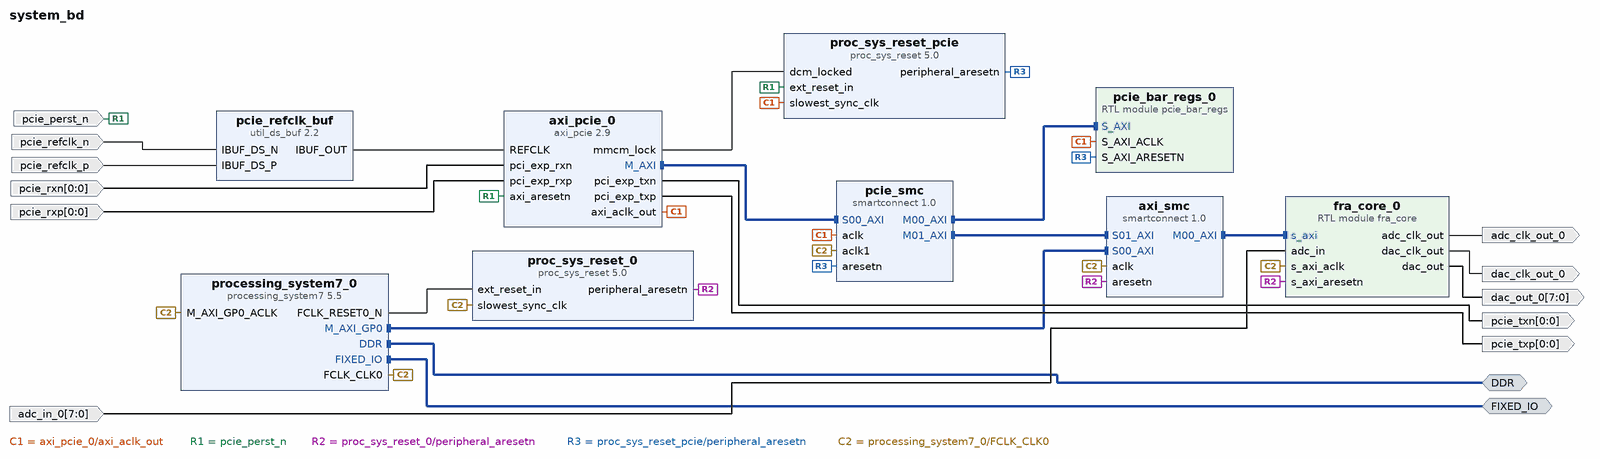
[diagram p0: block diagram of the top level]
# Vivado block design system_bd, xc7z015clg485-2, Vivado 2026.1
create_bd_design system_bd

create_bd_intf_port -mode Master -vlnv xilinx.com:interface:ddrx_rtl:1.0 DDR
create_bd_intf_port -mode Master -vlnv xilinx.com:display_processing_system7:fixedio_rtl:1.0 FIXED_IO
create_bd_port -dir O dac_clk_out_0
create_bd_port -dir O adc_clk_out_0
create_bd_port -dir O -from 7 -to 0 dac_out_0
create_bd_port -dir I -from 7 -to 0 adc_in_0
create_bd_port -dir O -from 0 -to 0 pcie_txp
create_bd_port -dir O -from 0 -to 0 pcie_txn
create_bd_port -dir I -from 0 -to 0 pcie_rxp
create_bd_port -dir I -from 0 -to 0 pcie_rxn
create_bd_port -dir I pcie_perst_n
create_bd_port -dir I pcie_refclk_p
create_bd_port -dir I pcie_refclk_n

create_bd_cell -type ip -vlnv xilinx.com:ip:processing_system7:5.5 processing_system7_0
set_property -dict [list \
  CONFIG.PCW_QSPI_GRP_SINGLE_SS_ENABLE 1 \
  CONFIG.PCW_QSPI_GRP_SINGLE_SS_IO {MIO 1 .. 6} \
  CONFIG.PCW_QSPI_PERIPHERAL_ENABLE 1 \
  CONFIG.PCW_QSPI_QSPI_IO {MIO 1 .. 6} \
  CONFIG.PCW_SINGLE_QSPI_DATA_MODE x4 \
  CONFIG.PCW_UART0_PERIPHERAL_ENABLE 1 \
  CONFIG.PCW_UART0_UART0_IO {MIO 14 .. 15} \
  CONFIG.PCW_UART1_PERIPHERAL_ENABLE 1 \
  CONFIG.PCW_UART1_UART1_IO {MIO 12 .. 13} \
  CONFIG.PCW_UART_PERIPHERAL_FREQMHZ 100 \
  CONFIG.PCW_UIPARAM_DDR_PARTNO {MT41J256M16 RE-125} \
] [get_bd_cells processing_system7_0]
# 68 more settings of processing_system7_0 are not shown: defaults, MIO pin electricals, DDR timing, and values the tool derives
create_bd_cell -type ip -vlnv xilinx.com:ip:proc_sys_reset:5.0 proc_sys_reset_0
create_bd_cell -type module -reference fra_core fra_core_0
create_bd_cell -type ip -vlnv xilinx.com:ip:smartconnect:1.0 axi_smc
set_property -dict {CONFIG.NUM_MI 1 CONFIG.NUM_SI 2} [get_bd_cells axi_smc]
create_bd_cell -type ip -vlnv xilinx.com:ip:axi_pcie:2.9 axi_pcie_0
set_property -dict [list \
  CONFIG.BAR0_ENABLED true \
  CONFIG.BAR0_SCALE Kilobytes \
  CONFIG.BAR0_SIZE 8 \
  CONFIG.BAR_64BIT false \
  CONFIG.DEVICE_ID 0x7021 \
  CONFIG.INCLUDE_RC PCI_Express_Endpoint_device \
  CONFIG.MAX_LINK_SPEED 2.5_GT/s \
  CONFIG.NO_OF_LANES X1 \
  CONFIG.PCIEBAR2AXIBAR_0 0x00000000 \
  CONFIG.PCIE_BLK_LOCN X0Y0 \
  CONFIG.REF_CLK_FREQ 100_MHz \
  CONFIG.VENDOR_ID 0x10EE \
  CONFIG.shared_logic_in_core true \
] [get_bd_cells axi_pcie_0]
create_bd_cell -type module -reference pcie_bar_regs pcie_bar_regs_0
create_bd_cell -type ip -vlnv xilinx.com:ip:smartconnect:1.0 pcie_smc
set_property -dict {CONFIG.NUM_CLKS 2 CONFIG.NUM_MI 2 CONFIG.NUM_SI 1} [get_bd_cells pcie_smc]
create_bd_cell -type ip -vlnv xilinx.com:ip:proc_sys_reset:5.0 proc_sys_reset_pcie
create_bd_cell -type ip -vlnv xilinx.com:ip:util_ds_buf:2.2 pcie_refclk_buf
set_property -dict {CONFIG.C_BUF_TYPE IBUFDSGTE CONFIG.C_SIZE 1} [get_bd_cells pcie_refclk_buf]

# ---- connections ----

connect_bd_intf_net [get_bd_intf_pins axi_pcie_0/M_AXI] [get_bd_intf_pins pcie_smc/S00_AXI]
connect_bd_intf_net [get_bd_intf_pins axi_smc/M00_AXI] [get_bd_intf_pins fra_core_0/s_axi]
connect_bd_intf_net [get_bd_intf_pins pcie_smc/M00_AXI] [get_bd_intf_pins pcie_bar_regs_0/S_AXI]
connect_bd_intf_net [get_bd_intf_pins pcie_smc/M01_AXI] [get_bd_intf_pins axi_smc/S01_AXI]
connect_bd_intf_net [get_bd_intf_ports DDR] [get_bd_intf_pins processing_system7_0/DDR]
connect_bd_intf_net [get_bd_intf_ports FIXED_IO] [get_bd_intf_pins processing_system7_0/FIXED_IO]
connect_bd_intf_net [get_bd_intf_pins processing_system7_0/M_AXI_GP0] [get_bd_intf_pins axi_smc/S00_AXI]
connect_bd_net -net adc_in_0_1 [get_bd_ports adc_in_0] [get_bd_pins fra_core_0/adc_in]
connect_bd_net [get_bd_pins axi_pcie_0/axi_aclk_out] \
  [get_bd_pins proc_sys_reset_pcie/slowest_sync_clk] [get_bd_pins pcie_smc/aclk] [get_bd_pins pcie_bar_regs_0/S_AXI_ACLK]
connect_bd_net [get_bd_pins axi_pcie_0/mmcm_lock] [get_bd_pins proc_sys_reset_pcie/dcm_locked]
connect_bd_net [get_bd_pins axi_pcie_0/pci_exp_txn] [get_bd_ports pcie_txn]
connect_bd_net [get_bd_pins axi_pcie_0/pci_exp_txp] [get_bd_ports pcie_txp]
connect_bd_net [get_bd_pins fra_core_0/adc_clk_out] [get_bd_ports adc_clk_out_0]
connect_bd_net [get_bd_pins fra_core_0/dac_clk_out] [get_bd_ports dac_clk_out_0]
connect_bd_net [get_bd_pins fra_core_0/dac_out] [get_bd_ports dac_out_0]
connect_bd_net [get_bd_ports pcie_perst_n] [get_bd_pins axi_pcie_0/axi_aresetn] [get_bd_pins proc_sys_reset_pcie/ext_reset_in]
connect_bd_net [get_bd_pins pcie_refclk_buf/IBUF_OUT] [get_bd_pins axi_pcie_0/REFCLK]
connect_bd_net [get_bd_ports pcie_refclk_n] [get_bd_pins pcie_refclk_buf/IBUF_DS_N]
connect_bd_net [get_bd_ports pcie_refclk_p] [get_bd_pins pcie_refclk_buf/IBUF_DS_P]
connect_bd_net [get_bd_ports pcie_rxn] [get_bd_pins axi_pcie_0/pci_exp_rxn]
connect_bd_net [get_bd_ports pcie_rxp] [get_bd_pins axi_pcie_0/pci_exp_rxp]
connect_bd_net [get_bd_pins proc_sys_reset_0/peripheral_aresetn] [get_bd_pins fra_core_0/s_axi_aresetn] [get_bd_pins axi_smc/aresetn]
connect_bd_net [get_bd_pins proc_sys_reset_pcie/peripheral_aresetn] [get_bd_pins pcie_smc/aresetn] [get_bd_pins pcie_bar_regs_0/S_AXI_ARESETN]
connect_bd_net [get_bd_pins processing_system7_0/FCLK_CLK0] \
  [get_bd_pins proc_sys_reset_0/slowest_sync_clk] [get_bd_pins fra_core_0/s_axi_aclk] [get_bd_pins axi_smc/aclk] \
  [get_bd_pins processing_system7_0/M_AXI_GP0_ACLK] [get_bd_pins pcie_smc/aclk1]
connect_bd_net [get_bd_pins processing_system7_0/FCLK_RESET0_N] [get_bd_pins proc_sys_reset_0/ext_reset_in]

# ---- address map ----
assign_bd_address -offset 0x00000000 -range 4K -target_address_space [get_bd_addr_spaces axi_pcie_0/M_AXI] [get_bd_addr_segs pcie_bar_regs_0/S_AXI/reg0]
assign_bd_address -offset 0x00001000 -range 4K -target_address_space [get_bd_addr_spaces axi_pcie_0/M_AXI] [get_bd_addr_segs fra_core_0/s_axi/reg0]
assign_bd_address -offset 0x43C00000 -range 64K -target_address_space [get_bd_addr_spaces processing_system7_0/Data] [get_bd_addr_segs fra_core_0/s_axi/reg0]

validate_bd_design
save_bd_design
